# Altium project 岸基板.PrjPcb
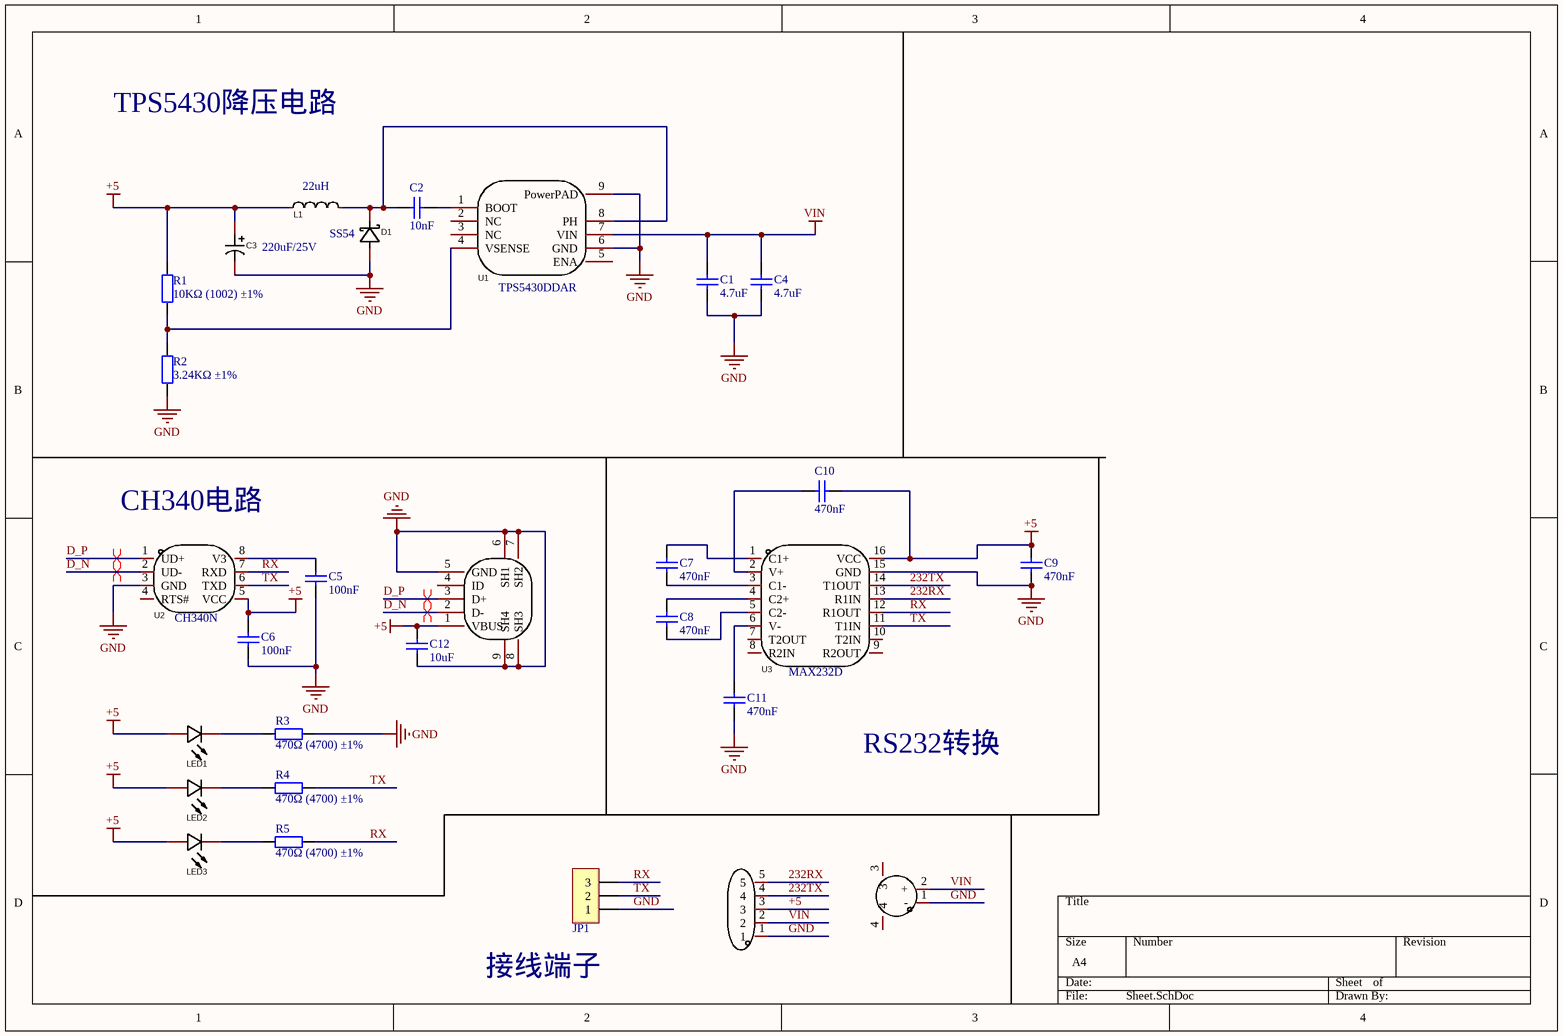
[diagram p0: Sheet.SchDoc]
1 sheet, 29 parts. Net scope: global (net labels, ports and power ports of the same name join across sheets).
Board file: PCB.PcbDoc

## Sheet Sheet.SchDoc
size A4

### Parts
C1  4.7uF  [0603_C]
C2  10nF  [0603_C]
C3  220uF/25V  [CAP-SMD_BD6.3-L6.6-W6.6-LS7.4-FD]
C4  4.7uF  [0603_C]
C5  100nF  [0603_C]
C6  100nF  [0603_C]
C7  470nF  [0603_C]
C8  470nF  [0603_C]
C9  470nF  [0603_C]
C10  470nF  [0603_C]
C11  470nF  [0603_C]
C12  10uF  [0603_C]
CN??  XT60PW-M  [CONN-TH_XT60PW-M]  (value not drawn)
D1  SS54  [SMB_L4.3-W3.6-LS5.4-RD]
JP1  HDR-1X3  [XH2.54-WI-3P]  (value not drawn)
JP2  KF2EDGR-3.5-5P  [CONN-TH_5P-P3.50_KF2EDGR-3.5-5P]  (value not drawn)
L1  22uH  [IND-SMD_L7.3-W6.8]
LED1  NCD0603R1_C84263  [LED0603-RD]  (value not drawn)
LED2  NCD0603R1_C84263  [LED0603-RD]  (value not drawn)
LED3  NCD0603R1_C84263  [LED0603-RD]  (value not drawn)
R1  10KΩ (1002) ±1%  [0603_R]
R2  3.24KΩ ±1%  [0603_R]
R3  470Ω (4700) ±1%  [0603_R]
R4  470Ω (4700) ±1%  [0603_R]
R5  470Ω (4700) ±1%  [0603_R]
U1  TPS5430DDAR  [ESOP-8_L4.9-W3.9-P1.27-LS6.0-TL-EP]
U2  CH340N  [SOP-8_L4.9-W3.9-P1.27-LS6.0-BL]
U3  MAX232D  [SOP-16_L9.9-W3.9-P1.27-LS6.0-BL]
USB  MicroXNJ  [MICRO-USB-SMD_MICROXNJ]  (value not drawn)

### Nets
+5: C3.1 C6.2 C9.2 C10.1 C12.2 JP2.3 L1.1 LED1.2(A) LED2.2(A) LED3.2(A) R1.2 U2.5(VCC) U3.16(VCC) USB.1(VBUS)
GND: C1.1 C3.2 C4.1 C5.1 C6.1 C9.1 C11.1 C12.1 CN??.1(-) D1.2(A) JP1.1 JP2.1 R2.1 R3.2 U1.6(GND) U1.9(PowerPAD) U2.3(GND) U3.15(GND) USB.5(GND) USB.6(SH1) USB.7(SH2) USB.8(SH3) USB.9(SH4)
VIN: C1.2 C4.2 CN??.2(+) JP2.2 U1.7(VIN)
232RX: JP2.5 U3.13(R1IN)
232TX: JP2.4 U3.14(T1OUT)
D_N: U2.2(UD-) USB.2(D-)
D_P: U2.1(UD+) USB.3(D+)
RX: JP1.3 R5.2 U2.7(RXD) U3.12(R1OUT)
TX: JP1.2 R4.2 U2.6(TXD) U3.11(T1IN)
NetC2_1: C2.1 D1.1(K) L1.2 U1.8(PH)
NetC2_2: C2.2 U1.1(BOOT)
NetC5_2: C5.2 U2.8(V3)
NetC7_1: C7.1 U3.3(C1-)
NetC7_2: C7.2 U3.1(C1+)
NetC8_1: C8.1 U3.5(C2-)
NetC8_2: C8.2 U3.4(C2+)
NetC10_2: C10.2 U3.2(V+)
NetC11_2: C11.2 U3.6(V-)
NetLED1_1: LED1.1(K) R3.1
NetLED2_1: LED2.1(K) R4.1
NetLED3_1: LED3.1(K) R5.1
NetR1_1: R1.1 R2.2 U1.4(VSENSE)

Not connected (* = marked no-connect by the designer): CN?? 3 4; U1 2(NC) 3(NC) 5(ENA); U2 4(RTS#); U3 7(T2OUT) 8(R2IN) 9(R2OUT) 10(T2IN); USB 4(ID)

### Layout directives
differential pair: D_N, D_P

### Notes on the sheet
- TPS5430降压电路
- (near U2) CH340电路
- RS232转换
- 接线端子

### Library data of the parts
C1 C4 = 0603 4.7uF (475) 10% 16V: 贴片电容; ComponentLink1Description: 供应商链接; ComponentLink1URL: http://www.szlcsc.com/product/details_20375.html; Package: 0603; Supplier: LC; SuppliersPartNumber: C19666
C2 = 0603 10nF (103) 10% 50V: 贴片电容; ComponentLink1Description: 供应商链接; ComponentLink1URL: http://www.szlcsc.com/product/details_58143.html; Package: 0603; Supplier: LC; SuppliersPartNumber: C57112
C3 = RVT1E221M0607: Manufacturer: ROQANG(容强); Name: 220uF; Symbol: RVT1E221M0607_C2918361; Add into BOM: yes; Value: 220uF; Tolerance: ±20%; Rated Voltage: 25V; φD: 6.3mm; L: 7.7mm; Ripple Current: 150mA@120Hz; Device: RVT1E221M0607; LCSC Part Name: 220uF ±20% 25V; Supplier Part: C2918361; Manufacturer Part: RVT1E221M0607; Supplier Footprint: SMD,D6.3xL7.7mm; JLCPCB Part Class: Extended Part; Datasheet: https://atta.szlcsc.com/upload/public/pdf/source/20211118/497C0614266278696CA52BDF245B991F.pdf; Supplier: LCSC; Convert to PCB: yes; Equivalent Series Resistance(ESR): -; Lifetime @ Temp: -; Operating Temperature: -40℃~+105℃
C5 C6 = 0603 100nF (104) 10% 50V: 贴片电容; ComponentLink1Description: 供应商链接; ComponentLink1URL: http://www.szlcsc.com/product/details_15331.html; Package: 0603; Supplier: LC; SuppliersPartNumber: C14663
C7-C11 = 0603 470nF (474) 10% 25V: 贴片电容; ComponentLink1Description: 供应商链接; ComponentLink1URL: http://www.szlcsc.com/product/details_1975.html; Package: 0603; Supplier: LC; SuppliersPartNumber: C1623
C12 = 0603 10uF (106) 10% 10V: 贴片电容; ComponentLink1Description: 供应商链接; ComponentLink1URL: http://www.szlcsc.com/product/details_20411.html; Package: 0603; Supplier: LC; SuppliersPartNumber: C19702
CN?? = XT60PW-M: Manufacturer: AMASS(艾迈斯); Add into BOM: yes; Name: XT60PW-M; Symbol: XT60PW-M; Device: XT60PW-M; LCSC Part Name: AMASS(艾迈斯)航模插头xt90连接器150公母对接pw锂电池公头 板插卧式XT60PW-M; Supplier Part: C98732; Manufacturer Part: XT60PW-M; Supplier Footprint: -; JLCPCB Part Class: Extended Part; Datasheet: https://atta.szlcsc.com/upload/public/pdf/source/20180125/C98732_15168617837851301983.pdf; Supplier: LCSC; Convert to PCB: yes
D1 = SS54_C2988643: Manufacturer: UMW(广东友台半导体); Add into BOM: yes; Reverse Voltage (Vr): 40V; Average Rectified Current (Io): 5A; Forward Voltage (Vf@If): 600mV@5A; Reverse Leakage Current (Ir): 1mA@40V; Name: SS54; Symbol: SS54_C2988643; Device: SS54_C2988643; LCSC Part Name: 40V 5A 600mV@5A; Supplier Part: C2988643; Manufacturer Part: SS54; Supplier Footprint: SMB; JLCPCB Part Class: Extended Part; Datasheet: https://atta.szlcsc.com/upload/public/pdf/source/20220412/DFE4B5D1FBAE230579785280D401C062.pdf; Supplier: LCSC; Convert to PCB: yes
JP1 = Header 3 Pitch2.54: 3P接插件; 版权归属: 源创客; BOM名称: 3P接插件; 学习资源: www.ooocke.com
JP2 = KF2EDGR-3.5-5P: Manufacturer: KEFA(科发); Add into BOM: yes; Connector Type: 板端/插座-闭口; Pitch: 3.5mm; Number of PINs Per Row: 5; Current Rating (Max): 8A; Voltage Rating (Max): 300V; Name: KF2EDGR-3.5-5P; Symbol: KF2EDGR-3.5-5P; Device: KF2EDGR-3.5-5P; LCSC Part Name: 板端/插座-闭口 3.5mm 排数:1 每排P数:5 弯针; Supplier Part: C441174; Manufacturer Part: KF2EDGR-3.5-5P; Supplier Footprint: P=3.5mm; JLCPCB Part Class: Extended Part; Datasheet: https://atta.szlcsc.com/upload/public/pdf/source/20191023/C441174_3952556C0659C22A17E7C4561A2B2291.pdf; Supplier: LCSC; Convert to PCB: yes; Number of Rows: 1; Mounting Style: 弯针; Wire Gauge - AWG: -; Wire Gauge - mm?: -; Operating Temperature Range: -40℃~+105℃; Color: 绿色
L1 = MWSA0603S-220MT: Manufacturer: Sunlord(顺络); Add into BOM: yes; Rated Current: 2.5A; Tolerance: ±20%; DC Resistance (DCR): 170mΩ; Name: 22uH; Symbol: MWSA0603S-220MT; Device: MWSA0603S-220MT; LCSC Part Name: 22uH ±20%; Supplier Part: C408453; Manufacturer Part: MWSA0603S-220MT; Supplier Footprint: SMD; JLCPCB Part Class: Extended Part; Datasheet: https://atta.szlcsc.com/upload/public/pdf/source/20190729/C408453_64865E9628338F56CB759A725C0B9F8F.pdf; Supplier: LCSC; Convert to PCB: yes; Width: 7mm; Length: 6.6mm; Height: 3mm; Value: 22uH
LED1-LED3 = 0603 LED-RD: Manufacturer: 国星光电; Symbol: FC-DA1608HRK-620D; Add into BOM: yes; Emitted Color: 红灯; Name: NCD0603R1; Device: NCD0603R1_C84263; LCSC Part Name: 红灯; Supplier Part: C84263; Manufacturer Part: NCD0603R1; Supplier Footprint: 0603; JLCPCB Part Class: Extended Part; Datasheet: https://atta.szlcsc.com/upload/public/pdf/source/20200820/C84263_DABC6A75E58F576973B407FDBA283D60.pdf; Supplier: LCSC; Convert to PCB: yes
R1 = 0603 10KΩ (1002) 1%: 贴片电阻; ComponentLink1Description: 供应商链接; ComponentLink1URL: http://www.szlcsc.com/product/details_26547.html; Package: 0603; Supplier: LC; SuppliersPartNumber: C25804
R2 = 0603 1KΩ (1001) 1%: 贴片电阻; ComponentLink1Description: 供应商链接; ComponentLink1URL: http://www.szlcsc.com/product/details_21904.html; Package: 0603; Supplier: LC; SuppliersPartNumber: C21190
R3-R5 = 0603 470Ω (4700) 1%: 贴片电阻; ComponentLink1Description: 供应商链接; ComponentLink1URL: http://www.szlcsc.com/product/details_23906.html; Package: 0603; Supplier: LC; SuppliersPartNumber: C23179
U1 = TPS5430DDAR: Manufacturer: TI(德州仪器); Add into BOM: yes; Function: 降压型; Name: TPS5430DDAR; Symbol: TPS5430DDAR; Device: TPS5430DDAR; LCSC Part Name: 降压型; Supplier Part: C9864; Manufacturer Part: TPS5430DDAR; Supplier Footprint: SO-8; JLCPCB Part Class: Basic Part; Datasheet: https://atta.szlcsc.com/upload/public/pdf/source/20161207/1481104217724.pdf; Supplier: LCSC; Convert to PCB: yes; Synchronous Rectification: -; Number of Outputs: -; Topology: -; Input Voltage: -; Output Current (Max): -; Switching Frequency: -
U2 = CH340N_C2977777: Designer: U?; Symbol: CH340N_C2977777; Device: CH340N_C2977777
U3 = MAX232D_C5342103: Manufacturer: Tokmas(托克马斯); Add into BOM: yes; Name: MAX232D; Symbol: MAX232D_C5342103; Device: MAX232D_C5342103; LCSC Part Name: RS232芯片; Supplier Part: C5342103; Manufacturer Part: MAX232D; Supplier Footprint: SOP-16; JLCPCB Part Class: Extended Part; Datasheet: https://atta.szlcsc.com/upload/public/pdf/source/20221230/256C03E6A712651C05B16D4BCED108A3.pdf; Supplier: LCSC; Convert to PCB: yes
USB = MicroXNJ: Manufacturer: SHOU HAN(首韩); Add into BOM: yes; Connector Type: Micro-B; Gender: 母座; Number of Contacts: 5P; Number of Ports: 1; Current Rating - Power (Max): 1A; Name: MicroXNJ; Symbol: MICROXNJ; Device: MicroXNJ; LCSC Part Name: Micro-B 母座 卧贴 小牛角有柱 卷边 编带; Supplier Part: C404969; Manufacturer Part: MicroXNJ; Supplier Footprint: SMD; JLCPCB Part Class: Extended Part; Datasheet: https://atta.szlcsc.com/upload/public/pdf/source/20220415/2494EDFF499AF6F852F7C820374B6AF3.pdf; Supplier: LCSC; Convert to PCB: yes; Standard: USB 2.0; Mounting Style: 卧贴; Operating Temperature Range: -20℃~+85℃